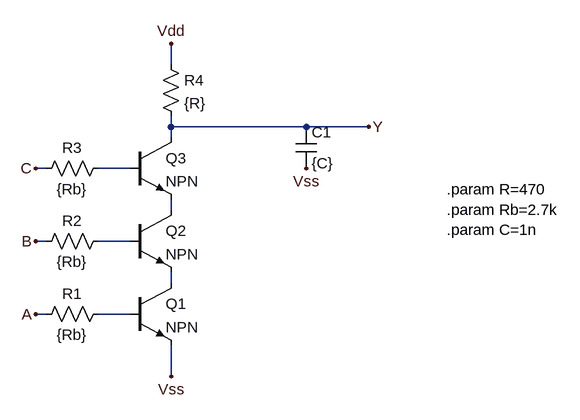
[diagram p0: schematic nand3.asc]
nand3.asc, the LTspice schematic file:
Version 4
SHEET 1 880 680
WIRE -560 -336 -560 -368
WIRE -560 -240 -560 -256
WIRE -352 -240 -560 -240
WIRE -256 -240 -352 -240
WIRE -560 -224 -560 -240
WIRE -752 -176 -768 -176
WIRE -624 -176 -672 -176
WIRE -560 -112 -560 -128
WIRE -752 -64 -768 -64
WIRE -624 -64 -672 -64
WIRE -560 0 -560 -16
WIRE -752 48 -768 48
WIRE -624 48 -672 48
WIRE -560 144 -560 96
FLAG -768 -64 B
FLAG -768 48 A
FLAG -768 -176 C
FLAG -560 144 Vss
FLAG -560 -368 Vdd
FLAG -256 -240 Y
FLAG -352 -176 Vss
SYMBOL npn -624 0 R0
SYMATTR InstName Q1
SYMBOL npn -624 -112 R0
SYMATTR InstName Q2
SYMBOL npn -624 -224 R0
SYMATTR InstName Q3
SYMBOL res -656 32 R90
WINDOW 0 0 56 VBottom 2
WINDOW 3 32 56 VTop 2
SYMATTR InstName R1
SYMATTR Value {Rb}
SYMBOL res -656 -80 R90
WINDOW 0 0 56 VBottom 2
WINDOW 3 32 56 VTop 2
SYMATTR InstName R2
SYMATTR Value {Rb}
SYMBOL res -656 -192 R90
WINDOW 0 0 56 VBottom 2
WINDOW 3 32 56 VTop 2
SYMATTR InstName R3
SYMATTR Value {Rb}
SYMBOL res -576 -352 R0
SYMATTR InstName R4
SYMATTR Value {R}
SYMBOL cap -368 -240 R0
SYMATTR InstName C1
SYMATTR Value {C}
TEXT -136 -144 Left 2 !.param R=470\n.param Rb=2.7k\n.param C=1n

The netlist it stands for:
* nand3.asc
Q1 N004 N005 Vss 0 NPN
Q2 N002 N003 N004 0 NPN
Q3 Y N001 N002 0 NPN
R1 N005 A {Rb}
R2 N003 B {Rb}
R3 N001 C {Rb}
R4 Vdd Y {R}
C1 Y Vss {C}
.model NPN NPN
.model PNP PNP
.lib standard.bjt
.param R=470
.param Rb=2.7k
.param C=1n
.backanno
.end